# EAGLE board time-circuits (EAGLE 9.1.0)
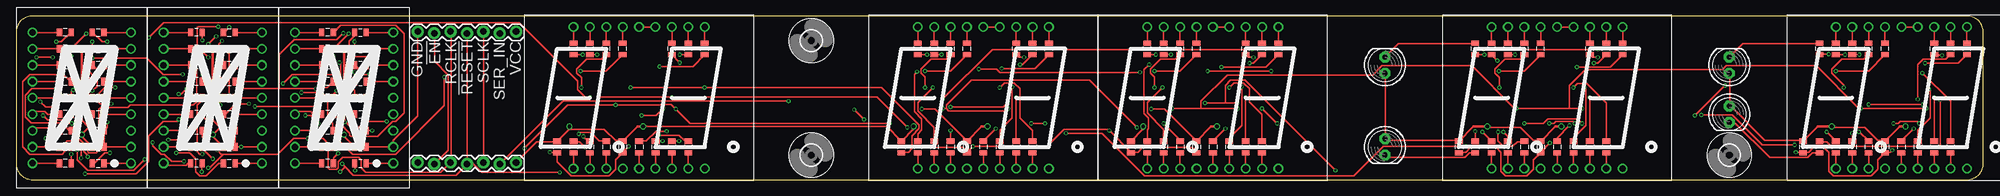
[diagram p2: board, top side]
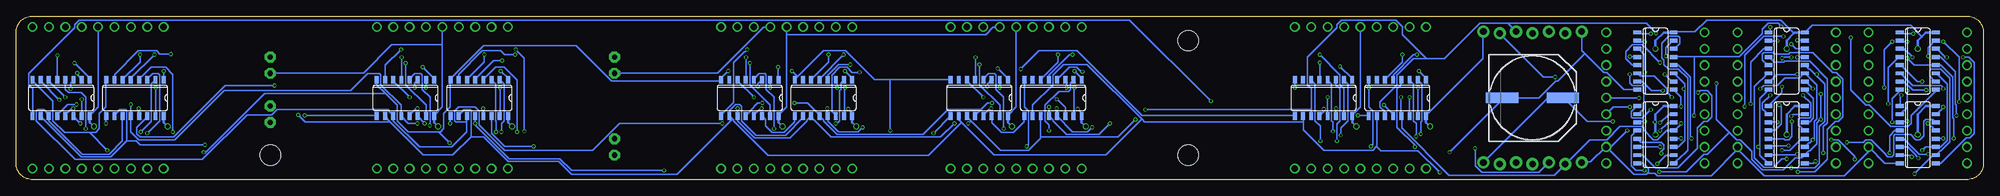
[diagram p3: board, bottom side, seen from below]

Size 304.8 x 25.4 mm. Coordinates in mm from the lower left corner, seen from the top.
Outline: 302.26,25.4 2.54,25.4 arc90 0,22.86 0,2.54 arc90 2.54,0 302.26,0 arc90 304.8,2.54 304.8,22.86 arc90 302.26,25.4
Copper layers (1*16): Top 0.0356mm / dielectric 1.5011mm / Bottom 0.0356mm
Design rules "OSHparkDruTented8mil": minimum track width 8mil, minimum drill 13mil, track to track 8mil, track to pad 8mil, pad to pad 8mil, via to via 8mil, smd to smd 5mil, copper to edge 15mil, drill to drill 6mil, minimum pad ring 5mil, minimum via ring 5mil, stop-mask expansion 3mil, vias tented up to drill 14mil, thermal gap 10mil
Net classes: 1 power: width 0.254 mm, clearance 0.203 mm

## Footprints (pad centres in the part's own frame; a part is rotated, then mirrored left to right if it is on the bottom)
0805 = smd 0.8 x 1.2: 1 -0.9,0; 2 0.9,0
PANASONIC_H13 = smd 5 x 1.6: + 4.7,0; - -4.7,0
3,2 = hole 3.2: 0,0
SO16 = smd 0.6 x 1.2: 1 -4.445,-2.8; 2 -3.175,-2.8; 3 -1.905,-2.8; 4 -0.635,-2.8; 5 0.635,-2.8; 6 1.905,-2.8; 7 3.175,-2.8; 8 4.445,-2.8; 9 4.445,2.8; 10 3.175,2.8; 11 1.905,2.8; 12 0.635,2.8; 13 -0.635,2.8; 14 -1.905,2.8; 15 -3.175,2.8; 16 -4.445,2.8
1X07_LOCK = drill 1.016 pad 1.88: 1 0,0.127; 2 2.54,-0.127; 3 5.08,0.127; 4 7.62,-0.127; 5 10.16,0.127; 6 12.7,-0.127; 7 15.24,0.127
LED5MM = drill 0.813 pad 1.676 octagon: A -1.27,0; K 1.27,0
DA08-11 = drill 1 pad 1.422: 1A -5.08,10.998; 1ANODE+ 0,10.998; 1B -2.54,10.998; 1C -5.08,-10.998; 1D -7.62,-10.998; 1DP -2.54,-10.998; 1E -10.16,-10.998; 1F -10.16,10.998; 1G -7.62,10.998; 2A 7.62,10.998; 2ANODE+ 2.54,10.998; 2B 10.16,10.998; 2C 7.62,-10.998; 2D 2.54,-10.998; 2DP 10.16,-10.998; 2E 0,-10.998; 2F 5.08,10.998; 2G 5.08,-10.998
PSC08-11 = drill 1: A -7.62,10.16; B 7.62,10.16; C 7.62,5.08; COM 7.62,-7.62; D 7.62,-2.54; DP 7.62,-5.08; E 7.62,-10.16; F -7.62,-10.16; G -7.62,-7.62; H -7.62,2.54; K -7.62,5.08; M -7.62,7.62; N 7.62,7.62; P 7.62,2.54; R 7.62,0; S -7.62,-2.54; T -7.62,-5.08; U -7.62,0

## Placement (x,y rotation side)
C1  [0805]  53.34,5.08 0 top
C2  [0805]  83.82,5.08 270 top
C3  [0805]  93.98,5.08 270 top
C4  [0805]  53.34,7.62 0 top
C5  [0805]  33.02,7.62 0 top
C6  [0805]  33.02,5.08 0 top
C7  [0805]  12.7,7.62 0 top
C8  [0805]  12.7,5.08 0 top
C9  [0805]  276.86,5.08 270 top
C10  [0805]  147.32,5.08 270 top
C11  [0805]  289.56,5.08 270 top
C12  [0805]  137.16,5.08 270 top
C13  [0805]  223.52,5.08 270 top
C14  [0805]  182.88,5.08 270 top
C15  [0805]  236.22,5.08 270 top
C16  [0805]  172.72,5.08 270 top
C17  [PANASONIC_H13]  69.85,12.7 0 bottom
H1  MOUNT-HOLE3.2  [3,2]  123.19,21.59 0 top
H2  MOUNT-HOLE3.2  [3,2]  265.43,3.81 0 top
H3  MOUNT-HOLE3.2  [3,2]  123.19,3.81 0 top
IC1  74LS595D  [SO16]  50.8,6.98 270 bottom
IC2  74LS595D  [SO16]  50.8,18.41 270 bottom
IC3  74LS595D  [SO16]  30.48,18.41 270 bottom
IC4  74LS595D  [SO16]  30.48,6.98 270 bottom
IC5  74LS595D  [SO16]  10.16,6.98 270 bottom
IC6  74LS595D  [SO16]  10.16,18.41 270 bottom
IC7  74LS595D  [SO16]  90.81,12.7 180 bottom
IC8  74LS595D  [SO16]  102.23,12.7 180 bottom
IC9  74LS595D  [SO16]  179.71,12.7 180 bottom
IC10  74LS595D  [SO16]  191.13,12.7 180 bottom
IC11  74LS595D  [SO16]  144.15,12.7 180 bottom
IC12  74LS595D  [SO16]  155.57,12.7 180 bottom
IC13  74LS595D  [SO16]  233.04,12.7 180 bottom
IC14  74LS595D  [SO16]  244.47,12.7 180 bottom
IC15  74LS595D  [SO16]  286.38,12.7 180 bottom
IC16  74LS595D  [SO16]  297.81,12.7 180 bottom
J1  [1X07_LOCK]  62.23,22.86 0 top
J2  [1X07_LOCK]  62.23,2.54 0 top
LED9  [LED5MM]  212.09,17.78 90 top
LED10  [LED5MM]  212.09,5.08 270 top
LED11  [LED5MM]  265.43,17.78 90 top
LED12  [LED5MM]  265.43,10.16 270 top
R1  [0805]  48.26,22.86 180 top
R2  [0805]  53.34,22.86 0 top
R7  [0805]  53.34,17.78 0 top
R8  [0805]  53.34,10.16 0 top
R9  [0805]  53.34,2.54 0 top
R10  [0805]  48.26,2.54 180 top
R11  [0805]  48.26,5.08 180 top
R12  [0805]  48.26,15.24 180 top
R13  [0805]  48.26,17.78 180 top
R14  [0805]  48.26,20.32 180 top
R15  [0805]  53.34,20.32 0 top
R16  [0805]  53.34,15.24 0 top
R17  [0805]  53.34,12.7 0 top
R18  [0805]  48.26,10.16 180 top
R19  [0805]  48.26,7.62 180 top
R20  [0805]  48.26,12.7 180 top
R21  [0805]  27.94,22.86 180 top
R22  [0805]  33.02,22.86 0 top
R23  [0805]  33.02,17.78 0 top
R24  [0805]  33.02,10.16 0 top
R25  [0805]  33.02,2.54 0 top
R26  [0805]  27.94,2.54 180 top
R27  [0805]  27.94,5.08 180 top
R28  [0805]  27.94,15.24 180 top
R29  [0805]  27.94,17.78 180 top
R30  [0805]  27.94,20.32 180 top
R31  [0805]  33.02,20.32 0 top
R32  [0805]  33.02,15.24 0 top
R33  [0805]  33.02,12.7 0 top
R34  [0805]  27.94,10.16 180 top
R35  [0805]  27.94,7.62 180 top
R36  [0805]  27.94,12.7 180 top
R37  [0805]  7.62,22.86 180 top
R38  [0805]  12.7,22.86 0 top
R39  [0805]  12.7,17.78 0 top
R40  [0805]  12.7,10.16 0 top
R41  [0805]  12.7,2.54 0 top
R42  [0805]  7.62,2.54 180 top
R43  [0805]  7.62,5.08 180 top
R44  [0805]  7.62,15.24 180 top
R45  [0805]  7.62,17.78 180 top
R46  [0805]  7.62,20.32 180 top
R47  [0805]  12.7,20.32 0 top
R48  [0805]  12.7,15.24 0 top
R49  [0805]  12.7,12.7 0 top
R50  [0805]  7.62,10.16 180 top
R51  [0805]  7.62,7.62 180 top
R52  [0805]  7.62,12.7 180 top
R53  [0805]  91.44,20.32 90 top
R54  [0805]  93.98,20.32 90 top
R55  [0805]  91.44,5.08 270 top
R56  [0805]  88.9,5.08 270 top
R57  [0805]  86.36,5.08 270 top
R58  [0805]  86.36,20.32 90 top
R59  [0805]  88.9,20.32 90 top
R60  [0805]  104.14,20.32 90 top
R61  [0805]  106.68,20.32 90 top
R62  [0805]  104.14,5.08 270 top
R63  [0805]  99.06,5.08 270 top
R64  [0805]  96.52,5.08 270 top
R65  [0805]  101.6,20.32 90 top
R66  [0805]  101.6,5.08 270 top
R67  [0805]  180.34,20.32 90 top
R68  [0805]  182.88,20.32 90 top
R69  [0805]  180.34,5.08 270 top
R70  [0805]  177.8,5.08 270 top
R71  [0805]  175.26,5.08 270 top
R72  [0805]  175.26,20.32 90 top
R73  [0805]  177.8,20.32 90 top
R74  [0805]  193.04,20.32 90 top
R75  [0805]  195.58,20.32 90 top
R76  [0805]  193.04,5.08 270 top
R77  [0805]  187.96,5.08 270 top
R78  [0805]  185.42,5.08 270 top
R79  [0805]  190.5,20.32 90 top
R80  [0805]  190.5,5.08 270 top
R81  [0805]  144.78,20.32 90 top
R82  [0805]  147.32,20.32 90 top
R83  [0805]  144.78,5.08 270 top
R84  [0805]  142.24,5.08 270 top
R85  [0805]  139.7,5.08 270 top
R86  [0805]  139.7,20.32 90 top
R87  [0805]  142.24,20.32 90 top
R88  [0805]  157.48,20.32 90 top
R89  [0805]  160.02,20.32 90 top
R90  [0805]  157.48,5.08 270 top
R91  [0805]  152.4,5.08 270 top
R92  [0805]  149.86,5.08 270 top
R93  [0805]  154.94,20.32 90 top
R94  [0805]  154.94,5.08 270 top
R95  [0805]  233.68,20.32 90 top
R96  [0805]  236.22,20.32 90 top
R97  [0805]  233.68,5.08 270 top
R98  [0805]  231.14,5.08 270 top
R99  [0805]  228.6,5.08 270 top
R100  [0805]  228.6,20.32 90 top
R101  [0805]  231.14,20.32 90 top
R102  [0805]  246.38,20.32 90 top
R103  [0805]  248.92,20.32 90 top
R104  [0805]  246.38,5.08 270 top
R105  [0805]  241.3,5.08 270 top
R106  [0805]  238.76,5.08 270 top
R107  [0805]  243.84,20.32 90 top
R108  [0805]  243.84,5.08 270 top
R109  [0805]  287.02,20.32 90 top
R110  [0805]  289.56,20.32 90 top
R111  [0805]  287.02,5.08 270 top
R112  [0805]  284.48,5.08 270 top
R113  [0805]  281.94,5.08 270 top
R114  [0805]  281.94,20.32 90 top
R115  [0805]  284.48,20.32 90 top
R116  [0805]  299.72,20.32 90 top
R117  [0805]  302.26,20.32 90 top
R118  [0805]  299.72,5.08 270 top
R119  [0805]  294.64,5.08 270 top
R120  [0805]  292.1,5.08 270 top
R121  [0805]  297.18,20.32 90 top
R122  [0805]  297.18,5.08 270 top
R123  [0805]  279.4,5.08 270 top
R124  [0805]  279.4,20.32 90 top
R125  [0805]  226.06,5.08 270 top
R126  [0805]  226.06,20.32 90 top
U$1  DA08-11  [DA08-11]  96.52,12.7 0 top
U$2  DA08-11  [DA08-11]  185.42,12.7 0 top
U$3  DA08-11  [DA08-11]  149.86,12.7 0 top
U$4  DA08-11  [DA08-11]  238.76,12.7 0 top
U$5  DA08-11  [DA08-11]  292.1,12.7 0 top
U$6  PSC08-11  [PSC08-11]  50.8,12.7 0 top
U$7  PSC08-11  [PSC08-11]  30.48,12.7 0 top
U$8  PSC08-11  [PSC08-11]  10.16,12.7 0 top

## Tracks (layer width: path | path; a pad name or v marks a point on that pad's centre or on a via)
DIN  (via drill 0.33)
  Top 0.203: v50.09,7.62 50.09,7.42 49.99,7.31 49.99,6.1 52.12,3.96 58.83,3.96 66.34,11.48 v66.34,15.95
  Bottom 0.203: v50.09,7.62 48.87,8.84 48.06,8.84 IC1.14 | v66.34,15.95 68.17,15.95 74.88,22.66 J1.6
G  (via drill 0.33)
  Top 0.203: v4.17,9.96 4.88,9.25 7.21,9.25 7.72,8.74 v8.64,8.74 8.84,8.74 9.35,8.23 9.35,6.71 9.86,6.2 9.96,6.2 11.07,5.08 11.07,4.37 11.28,4.17 12.39,4.17 12.8,4.57 12.8,10.87 13.11,11.18 17.27,11.18 17.68,11.58 27.43,11.58 27.94,12.09 v27.94,13.11 27.94,18.39 28.09,18.54 | 28.09,18.54 28.55,19 v28.85,19 | v31.29,23.77 28.25,23.77 28.04,23.57 28.04,18.59 28.09,18.54 | v90.22,12.8 v101.6,12.8 133.4,12.8 v138.07,8.13 | J1.2 64.82,22.66 64.82,18.39 66.95,16.26 66.95,4.57 64.82,2.44 J2.2 | v44.81,9.96 45.62,9.96 v46.84,8.74 | v143.56,11.07 144.07,11.07 144.12,11.02 | 144.12,11.02 144.47,10.67 153.31,10.67 v153.72,11.07 | v189.28,11.07 183.59,11.07 | 183.59,11.07 v179.12,11.07 | v173.63,8.13 166.32,15.44 148.03,15.44 144.17,11.58 144.17,11.07 144.12,11.02 | v242.62,11.07 240.69,11.07 | 240.69,11.07 v232.46,11.07 232.16,11.07 225.55,17.68 211.63,17.68 210.21,16.26 187.66,16.26 183.59,12.19 183.59,11.07 | v295.96,11.07 v285.8,11.07 285.5,11.07 278.89,17.68 264.97,17.68 264.36,17.07 243.13,17.07 240.69,14.63 240.69,11.07
  Bottom 0.203: v8.64,8.74 8.13,8.23 8.03,8.23 7.42,7.62 IC5.13 | v4.17,9.96 4.17,11.58 4.37,11.79 4.37,16.76 6.6,19 7.32,19 IC6.13 | v27.94,13.11 26.72,11.89 26.72,9.75 26.92,9.55 28.45,9.55 28.65,9.35 28.65,8.43 28.45,8.23 28.35,8.23 27.74,7.62 IC4.13 | v28.85,19 27.74,19 IC3.13 | 44.81,19.1 37.8,19.1 34.24,22.66 34.24,23.37 33.33,24.28 31.8,24.28 v31.29,23.77 | 44.81,19.1 47.95,19.1 IC2.13 | v101.6,12.8 IC8.13 | v90.22,12.8 90.22,9.96 IC7.13 90.12,9.85 90.12,8.03 82.8,0.71 66.45,0.71 64.82,2.34 J2.2 64.72,2.44 60.96,6.2 58.32,6.2 56.29,8.23 52.83,8.23 52.63,8.03 52.63,7.72 51.1,6.2 50.49,6.2 49.07,7.62 IC1.13 47.85,7.62 47.04,8.43 47.04,8.53 v46.84,8.74 | v44.81,9.96 44.81,19.1 | v143.56,11.07 143.56,9.96 IC11.13 143.56,9.85 141.12,7.42 138.79,7.42 v138.07,8.13 | v153.72,11.07 153.92,11.07 154.94,10.06 IC12.13 | v179.12,11.07 179.12,9.96 IC9.13 179.02,9.85 179.02,9.04 177.39,7.42 174.35,7.42 v173.63,8.13 | v189.28,11.07 189.48,11.07 190.5,10.06 IC10.13 | v232.46,11.07 232.46,9.96 IC13.13 | v242.62,11.07 242.82,11.07 243.84,10.06 IC14.13 | v285.8,11.07 285.8,9.96 IC15.13 | v295.96,11.07 296.16,11.07 297.18,10.06 IC16.13
GND  (via drill 0.33)
  Top 0.203: C1.2 U$6.COM 58.42,6.1 62.18,9.85 62.18,22.96 J1.1 | v55.17,7.62 C4.2 | 13.61,7.62 13.61,5.08 | v14.12,8.94 14.12,8.13 13.61,7.62 | 13.61,7.62 C7.2 | U$8.COM 13.61,5.08 | 13.61,5.08 C8.2 | 33.93,5.08 33.93,7.62 C5.2 | U$7.COM v34.85,5.08 33.93,5.08 | 33.93,5.08 C6.2 | v94.89,5.18 93.98,4.27 C3.2 93.98,4.17 92.86,3.05 92.86,1.63 91.85,0.61 85.95,0.61 83.82,2.74 C2.2 83.82,4.27 v82.7,4.27 | v95.2,14.33 v106.68,14.33 134.11,14.33 139.9,8.53 139.9,7.92 138.79,6.81 138.79,4.88 138.84,4.83 | 276.86,4.27 277.77,4.27 278.49,4.98 280.11,4.98 280.82,4.27 280.82,1.32 281.53,0.61 287.43,0.61 288.44,1.63 288.44,3.05 289.56,4.17 C11.2 289.56,4.27 290.37,4.27 v290.68,4.57 | C13.2 223.52,4.27 224.64,4.27 225.35,4.98 229.31,4.98 230.02,4.27 230.02,1.32 230.73,0.61 234.09,0.61 235.1,1.63 235.1,3.05 236.22,4.17 C15.2 236.22,4.27 v237.64,5.69 | 138.84,4.83 138.99,4.98 146.61,4.98 147.32,4.27 | 138.84,4.83 138.28,4.27 137.16,4.27 C12.2 | 147.32,4.27 v148.23,5.18 159.72,5.18 162.36,7.82 169.16,7.82 v169.37,7.62 172.72,4.27 | 147.32,4.27 C10.2 | 172.72,4.27 173.84,4.27 174.55,4.98 182.17,4.98 182.88,4.27 C14.2 | v184.61,16.87 v194.46,16.87 | 172.72,4.27 C16.2 | v275.74,4.27 276.86,4.27 | 276.86,4.27 C9.2
  Bottom 0.203: 53.65,2.54 IC1.8 52.73,2.54 51.92,1.73 51.92,1.12 51.97,1.07 | 51.97,1.07 52.22,0.81 54.15,0.81 U$6.COM | v55.17,7.62 58.01,4.77 U$6.COM | J2.1 62.18,2.74 60.86,2.74 58.52,5.08 U$6.COM | 13.01,14.02 IC6.8 13.01,13.92 13.01,13.72 14.12,12.6 v14.12,8.94 | IC5.8 13.01,2.54 15.24,2.54 U$8.COM 17.48,4.67 21.54,0.61 33.93,0.61 38.1,4.77 U$7.COM 38.1,4.67 42.16,0.61 50.49,0.61 50.9,1.02 51.92,1.02 51.97,1.07 | 34.65,5.08 34.65,12.6 33.33,13.92 IC3.8 33.33,14.02 | 34.65,5.08 34.65,3.76 34.04,3.15 33.93,3.15 33.33,2.54 IC4.8 | 34.65,5.08 v34.85,5.08 | 106.68,15.54 IC8.8 v106.68,14.33 | 95.3,15.54 IC7.8 95.2,15.44 v95.2,14.33 95.2,11.28 94.59,10.67 94.59,5.49 v94.89,5.18 | 53.65,14.02 IC2.8 53.75,14.02 55.68,14.02 58.32,16.66 58.83,16.66 61.72,19.56 | 61.72,19.56 62.18,20.02 62.18,22.96 J1.1 | 74.27,12.7 68.89,12.7 66.24,15.34 65.94,15.34 61.72,19.56 | 74.27,12.7 C17.- 74.47,12.7 | 74.27,12.7 v82.7,4.27 | 290.88,15.54 IC15.8 290.88,15.44 290.88,11.28 291.9,10.26 291.9,7.92 292.51,7.31 293.42,7.31 | 293.42,7.31 297.28,7.31 299.11,9.14 299.11,12.19 302.26,15.34 IC16.8 302.26,15.54 | 293.42,7.31 v290.68,4.57 | 237.54,15.54 IC13.8 | 239.37,7.42 244.04,7.42 245.77,9.14 245.77,11.58 247.65,13.46 | 239.37,7.42 239.06,7.42 238.56,7.92 238.56,10.26 237.54,11.28 237.54,15.44 IC13.8 | 247.65,13.46 248.92,14.73 IC14.8 248.92,15.54 | 239.37,7.42 v237.64,5.69 | 148.64,15.54 IC11.8 148.54,15.44 148.54,11.28 147.93,10.67 147.93,5.49 v148.23,5.18 | 169.37,15.54 171.81,15.54 176.28,20.02 179.73,20.02 183.74,16 | 169.37,15.54 160.02,15.54 IC12.8 | 183.74,16 184.2,15.54 IC9.8 | v194.46,16.87 195.58,15.75 195.58,15.54 IC10.8 195.58,15.44 195.68,15.34 212.55,15.34 218.03,20.83 232.36,20.83 237.54,15.65 IC13.8
  Bottom 0.203: 183.74,16 v184.61,16.87 | 169.37,15.54 v169.37,7.62 | v275.74,4.27 275.44,4.27 266.29,13.41 247.7,13.41 247.65,13.46
N$1  (via drill 0.33)
  Top 0.203: v5.69,19 v3.15,19
  Bottom 0.203: IC5.9 6.6,2.54 2.64,6.5 2.13,6.5 1.42,7.21 1.42,18.19 2.23,19 v3.15,19 | v5.69,19 5.89,19 7.21,20.32 IC6.14
N$2
  Bottom 0.203: IC2.14 47.85,20.32 47.04,21.13 47.04,22.05 47.24,22.25 48.77,22.25 49.78,21.23 49.78,18.9 49.48,18.59 49.48,17.88 48.77,17.17 47.24,17.17 45.82,15.75 45.82,4.57 47.24,3.15 47.35,3.15 47.95,2.54 IC1.9
N$3  (via drill 0.33)
  Top 0.203: v50.09,8.84 51.71,7.21 51.71,6.91 51.92,6.71 55.98,6.71 58.32,9.04 58.83,9.04 60.15,10.36 60.15,22.66 58.83,23.98 50.29,23.98 49.17,22.86 R1.1
  Bottom 0.203: IC1.15 48.77,10.16 v50.09,8.84
N$4  (via drill 0.33)
  Top 0.203: v51.51,10.87 51.31,11.07 51.31,18.69 51.61,19 51.61,21.54 52.43,22.35 52.43,22.86 R2.1
  Bottom 0.203: v51.51,10.87 52.83,9.55 54.36,9.55 54.56,9.75 54.56,10.57 53.65,11.48 IC1.1
N$5  (via drill 0.33)
  Top 0.203: v54.76,16.36 53.95,16.36 52.53,17.78 R7.1
  Bottom 0.203: v54.76,16.36 54.76,15.04 54.36,14.63 52.83,14.63 52.63,14.43 52.63,10.97 52.83,10.77 52.93,10.77 53.54,10.16 IC1.2
N$6  (via drill 0.33)
  Top 0.203: v52.43,9.04 52.43,10.16 R8.1
  Bottom 0.203: v52.43,9.04 53.44,9.04 53.54,8.94 IC1.3
N$7  (via drill 0.33)
  Top 0.203: v52.53,1.42 52.53,2.54 R9.1
  Bottom 0.203: v52.53,1.42 53.85,1.42 54.56,2.13 54.56,6.81 53.75,7.62 IC1.4
N$8  (via drill 0.33)
  Top 0.203: v49.89,4.06 49.17,3.35 49.17,2.54 R10.1
  Bottom 0.203: v49.89,4.06 49.89,4.37 49.48,4.77 49.48,5.38 49.89,5.79 53.03,5.79 53.54,6.3 IC1.5
N$9  (via drill 0.33)
  Top 0.203: v50.09,5.08 R11.1
  Bottom 0.203: IC1.6 v50.09,5.08
N$10  (via drill 0.33)
  Top 0.203: v44.2,13.51 46.74,13.51 47.55,14.33 48.16,14.33 49.07,15.24 R12.1
  Bottom 0.203: v44.2,13.51 43.89,13.82 42.77,13.82 42.06,13.11 42.06,9.75 42.77,9.04 43.28,9.04 44.3,8.03 44.3,4.88 47.35,1.83 50.8,1.83 52.73,3.76 53.54,3.76 IC1.7
N$11  (via drill 0.33)
  Top 0.203: v49.17,19.2 49.17,17.78 R13.1
  Bottom 0.203: v49.17,19.2 49.17,20.52 48.06,21.64 IC2.15
N$12  (via drill 0.33)
  Top 0.203: v51.51,22.66 49.17,20.32 R14.1
  Bottom 0.203: v51.51,22.66 53.34,22.66 53.54,22.86 IC2.1
N$13  (via drill 0.33)
  Top 0.203: v52.43,21.44 52.43,20.32 R15.1
  Bottom 0.203: v52.43,21.44 53.44,21.44 53.54,21.54 IC2.2
N$14
  Top 0.203: U$1.1A R53.2
N$15  (via drill 0.33)
  Top 0.203: v119.69,12.19 84.73,12.19 74.98,2.44 J2.6
  Bottom 0.203: IC16.9 302.26,14.12 302.87,14.73 302.87,16.46 295.76,23.57 295.76,24.08 295.05,24.79 132.28,24.79 v119.69,12.19
N$16
  Top 0.203: U$1.1B R54.2
N$17
  Top 0.203: U$1.1C R55.2
N$18  (via drill 0.33)
  Top 0.203: v52.43,16.66 52.43,15.24 R16.1
  Bottom 0.203: v52.43,16.66 52.43,19.3 53.44,20.32 IC2.3
N$19  (via drill 0.33)
  Top 0.203: v54.76,19.1 52.32,19.1 51.71,18.49 51.71,14.53 52.43,13.82 52.43,12.7 R17.1
  Bottom 0.203: v54.76,19.1 53.65,19.1 IC2.4
N$20
  Top 0.203: U$1.1D R56.2
N$21
  Top 0.203: U$1.1E R57.2
N$22
  Top 0.203: U$1.1F R58.2
N$23
  Top 0.203: U$1.1G R59.2
N$24
  Top 0.203: U$1.2A R60.2
N$25
  Top 0.203: U$1.2B R61.2
N$26
  Top 0.203: U$1.2C R62.2
N$27  (via drill 0.33)
  Top 0.203: v50.09,18.19 50.29,17.98 50.29,12.39 49.17,11.28 49.17,10.16 R18.1
  Bottom 0.203: v50.09,18.19 52.83,20.93 54.36,20.93 55.37,19.91 55.37,18.8 54.36,17.78 IC2.5
N$28  (via drill 0.33)
  Top 0.203: v48.26,12.8 48.26,9.55 49.07,8.74 49.07,7.62 R19.1
  Bottom 0.203: v48.26,12.8 49.07,13.61 49.07,14.12 51,16.05 53.14,16.05 53.54,16.46 IC2.6
N$29  (via drill 0.33)
  Top 0.203: v49.68,13.82 49.17,13.31 49.17,12.7 R20.1
  Bottom 0.203: v49.68,13.82 51.41,13.82 52.83,15.24 IC2.7
N$30
  Top 0.203: U$6.A R1.2
N$31
  Top 0.203: U$6.B R2.2
N$32
  Top 0.203: U$6.C R7.2
N$33  (via drill 0.33)
  Top 0.203: v54.76,11.28 54.25,10.77 54.25,10.16 R8.2
  Bottom 0.203: v54.76,11.28 57.3,11.28 U$6.D
N$34
  Top 0.203: U$6.E R9.2
N$35
  Top 0.203: U$6.F R10.2
N$36
  Top 0.203: U$6.G R11.2
N$37
  Top 0.203: U$6.H R12.2
N$38
  Top 0.203: U$6.K R13.2
N$39
  Top 0.203: U$6.M R14.2
N$40
  Top 0.203: U$6.N R15.2
N$41
  Top 0.203: U$6.P R16.2
N$42  (via drill 0.33)
  Top 0.203: v53.34,12.7 R17.2
  Bottom 0.203: U$6.R v53.34,12.7
N$43
  Top 0.203: R18.2 46.02,10.16 45.62,10.57 43.59,10.57 U$6.S
N$44
  Top 0.203: U$6.T R19.2
N$45
  Top 0.203: U$6.U R20.2
N$46
  Bottom 0.203: IC4.14 27.64,8.94 26.92,8.94 26.31,9.55 26.31,12.6 27.64,13.92 IC3.9
N$47  (via drill 0.33)
  Top 0.203: v28.85,21.64 28.85,22.86 R21.1
  Bottom 0.203: v28.85,21.64 27.74,21.64 IC3.15
N$48  (via drill 0.33)
  Top 0.203: v33.02,23.67 32.21,22.86 R22.1
  Bottom 0.203: v33.02,23.67 33.02,23.06 33.22,22.86 IC3.1
N$49  (via drill 0.33)
  Top 0.203: v31.9,21.54 31.39,21.03 31.39,19.61 32.11,18.9 32.11,17.78 R23.1
  Bottom 0.203: v31.9,21.54 33.22,21.54 IC3.2
N$50  (via drill 0.33)
  Top 0.203: R24.1 32.41,10.16 34.04,11.79 v36.07,11.79
  Bottom 0.203: v36.07,11.79 36.07,18.29 34.04,20.32 IC3.3
N$51  (via drill 0.33)
  Top 0.203: R25.1 31.39,2.54 29.46,0.61 28.45,0.61 27.84,1.22 27.84,3.25 26.92,4.17 v24.79,4.17
  Bottom 0.203: v24.79,4.17 24.79,8.23 24.18,8.84 24.18,15.65 26.92,18.39 30.79,18.39 30.89,18.29 32.41,18.29 33.22,19.1 IC3.4
N$52  (via drill 0.33)
  Top 0.203: v28.75,1.22 28.75,2.54 R26.1
  Bottom 0.203: v28.75,1.22 26.11,1.22 24.18,3.15 24.18,7.82 22.96,9.04 22.45,9.04 21.74,9.75 21.74,15.65 22.76,16.66 23.37,16.66 26.42,19.71 29.97,19.71 30.18,19.51 32.31,19.51 32.51,19.71 34.04,19.71 34.24,19.51 34.24,18.59 33.43,17.78 IC3.5
N$53  (via drill 0.33)
  Top 0.203: v30.48,3.25 28.85,4.88 28.85,5.08 R27.1
  Bottom 0.203: v30.48,3.25 31.19,3.25 32.51,1.93 34.04,1.93 35.46,3.35 35.46,14.43 33.33,16.56 IC3.6
N$54  (via drill 0.33)
  Top 0.203: v28.85,16.36 28.85,15.24 R28.1
  Bottom 0.203: v28.85,16.36 32,16.36 33.12,15.24 IC3.7
N$55  (via drill 0.33)
  Top 0.203: v29.77,9.85 29.77,16.87 28.85,17.78 R29.1
  Bottom 0.203: IC4.15 29.46,10.16 v29.77,9.85
N$56  (via drill 0.33)
  Top 0.203: v29.77,19 28.85,19.91 28.85,20.32 R30.1 | v31.19,14.43 v31.19,18.9
  Bottom 0.203: v29.77,19 31.09,19 v31.19,18.9 | v31.19,14.43 31.19,13.51 33.22,11.48 IC4.1
N$57  (via drill 0.33)
  Top 0.203: v33.02,13.11 33.02,19.51 32.21,20.32 R31.1
  Bottom 0.203: v33.02,13.11 34.24,11.89 34.24,10.97 34.04,10.77 33.93,10.77 33.33,10.16 IC4.2
N$58  (via drill 0.33)
  Top 0.203: v31.9,8.94 30.99,9.85 30.99,13.31 32.11,14.43 32.11,15.24 R32.1
  Bottom 0.203: v31.9,8.94 33.22,8.94 IC4.3
N$59  (via drill 0.33)
  Top 0.203: v31.6,11.58 31.6,12.19 32.11,12.7 R33.1
  Bottom 0.203: IC4.4 32.31,7.62 31.29,8.64 31.29,11.28 v31.6,11.58
N$60  (via drill 0.33)
  Top 0.203: v29.67,9.04 28.85,9.85 28.85,10.16 R34.1
  Bottom 0.203: v29.67,9.04 29.67,6.71 30.18,6.2 30.79,6.2 30.89,6.3 33.22,6.3 IC4.5
N$61  (via drill 0.33)
  Top 0.203: v30.18,5.28 28.85,6.6 28.85,7.62 R35.1
  Bottom 0.203: v30.18,5.28 33.02,5.28 33.22,5.08 IC4.6
N$62  (via drill 0.33)
  Top 0.203: v28.85,3.96 28.45,3.96 28.04,4.37 28.04,11.58 28.75,12.29 28.75,12.7 R36.1
  Bottom 0.203: v28.85,3.96 28.96,3.86 33.22,3.86 IC4.7
N$63
  Top 0.203: U$7.A R21.2
N$64
  Top 0.203: U$7.B R22.2
N$65
  Top 0.203: U$7.C R23.2
N$66
  Top 0.203: U$7.D R24.2
N$67
  Top 0.203: U$7.E R25.2
N$68
  Top 0.203: R26.2 26.62,2.54 26.31,2.23 23.16,2.23 U$7.F
N$69
  Top 0.203: U$7.G R27.2
N$70
  Top 0.203: U$7.H R28.2
N$71
  Top 0.203: U$7.K R29.2
N$72
  Top 0.203: U$7.M R30.2
N$73
  Top 0.203: U$7.N R31.2
N$74
  Top 0.203: U$7.P R32.2
N$75
  Top 0.203: U$7.R R33.2
N$76
  Top 0.203: U$7.S R34.2
N$77
  Top 0.203: U$7.T R35.2
N$78
  Top 0.203: U$7.U R36.2
N$79  (via drill 0.33)
  Top 0.203: v6.2,11.28 4.57,11.28 v3.76,12.09 | v6.2,21.44 7.01,21.44 8.43,22.86 R37.1
  Bottom 0.203: v6.2,11.28 6.2,11.18 6.6,10.77 6.71,10.77 7.32,10.16 IC5.15 | v3.76,12.09 3.76,19 v6.2,21.44
N$80  (via drill 0.33)
  Top 0.203: v12.7,13.11 12.7,13.31 13.72,14.33 v15.34,14.33 | v14.12,21.44 13.31,21.44 11.89,22.86 R38.1
  Bottom 0.203: v12.7,13.11 12.9,12.9 12.9,11.48 IC5.1 | v15.34,14.33 15.34,20.22 v14.12,21.44
N$81  (via drill 0.33)
  Top 0.203: v11.79,13.82 12.29,14.33 12.39,14.33 12.6,14.53 12.6,17.07 11.89,17.78 R39.1
  Bottom 0.203: v11.79,13.82 11.79,11.18 12.19,10.77 12.29,10.77 12.9,10.16 IC5.2
N$82  (via drill 0.33)
  Top 0.203: v11.79,9.04 11.79,10.16 R40.1
  Bottom 0.203: v11.79,9.04 12.8,9.04 12.9,8.94 IC5.3
N$83  (via drill 0.33)
  Top 0.203: R41.1 12.09,2.54 13.72,4.17 v14.53,4.17
  Bottom 0.203: v14.53,4.17 14.53,6.81 13.72,7.62 IC5.4
N$84  (via drill 0.33)
  Top 0.203: v8.53,3.96 8.53,2.54 R42.1
  Bottom 0.203: v8.53,3.96 9.96,3.96 12.29,6.3 12.9,6.3 IC5.5
N$85  (via drill 0.33)
  Top 0.203: R43.1 9.04,5.08 9.14,5.18 9.75,5.18 10.06,4.88 v10.06,3.35
  Bottom 0.203: v10.06,3.35 10.46,3.76 10.46,3.86 11.68,5.08 IC5.6
N$86  (via drill 0.33)
  Top 0.203: v11.07,3.56 11.07,3.76 10.46,4.37 10.46,5.08 9.75,5.79 9.25,5.79 9.04,5.99 7.92,5.99 7.52,5.59 7.52,4.37 7.11,3.96 2.13,3.96 1.02,5.08 1.02,15.24 2.13,16.36 7.32,16.36 8.43,15.24 R44.1
  Bottom 0.203: v11.07,3.56 11.28,3.76 12.9,3.76 IC5.7
N$87  (via drill 0.33)
  Top 0.203: v8.53,19.2 8.53,17.78 R45.1
  Bottom 0.203: v8.53,19.2 8.53,20.52 7.42,21.64 IC6.15
N$88  (via drill 0.33)
  Top 0.203: v10.87,22.66 8.53,20.32 R46.1
  Bottom 0.203: v10.87,22.66 12.7,22.66 12.9,22.86 IC6.1
N$89  (via drill 0.33)
  Top 0.203: v11.79,21.44 11.79,20.32 R47.1
  Bottom 0.203: v11.79,21.44 12.8,21.44 12.9,21.54 IC6.2
N$90  (via drill 0.33)
  Top 0.203: v10.97,19 10.97,17.17 11.79,16.36 11.79,15.24 R48.1
  Bottom 0.203: v10.97,19 12.29,20.32 IC6.3
N$91  (via drill 0.33)
  Top 0.203: R49.1 12.09,12.7 13.01,11.79 v14.73,11.79
  Bottom 0.203: v14.73,11.79 14.73,17.37 13.01,19.1 IC6.4
N$92  (via drill 0.33)
  Top 0.203: v9.45,15.24 9.45,12.19 8.53,11.28 8.53,10.16 R50.1
  Bottom 0.203: v9.45,15.24 10.26,15.24 12.8,17.78 IC6.5
N$93  (via drill 0.33)
  Top 0.203: R51.1 8.23,7.62 7.01,8.84 2.34,8.84 1.42,9.75 1.42,13.11 2.44,14.12 v6.2,14.12
  Bottom 0.203: v6.2,14.12 6.4,14.33 6.4,14.43 6.6,14.63 10.97,14.63 12.9,16.56 IC6.6
N$94  (via drill 0.33)
  Top 0.203: v8.84,13.92 8.53,13.61 8.53,12.7 R52.1
  Bottom 0.203: v8.84,13.92 10.97,13.92 12.29,15.24 IC6.7
N$95
  Top 0.203: U$8.A R37.2
N$96
  Top 0.203: U$8.B R38.2
N$97
  Top 0.203: U$8.C R39.2
N$98
  Top 0.203: U$8.D R40.2
N$99
  Top 0.203: U$8.E R41.2
N$100
  Top 0.203: U$8.F R42.2
N$101
  Top 0.203: U$8.G R43.2
N$102
  Top 0.203: U$8.H R44.2
N$103
  Top 0.203: U$8.K R45.2
N$104
  Top 0.203: U$8.M R46.2
N$105
  Top 0.203: U$8.N R47.2
N$106
  Top 0.203: U$8.P R48.2
N$107
  Top 0.203: U$8.R R49.2
N$108
  Top 0.203: R50.2 4.88,10.16 4.47,10.57 2.95,10.57 U$8.S
N$109
  Top 0.203: R51.2 5.28,7.62 4.88,8.03 2.95,8.03 U$8.T
N$110
  Top 0.203: U$8.U R52.2
N$111  (via drill 0.33)
  Top 0.203: v30.99,22.25 v29.77,21.03 | v46.84,11.38 v36.98,11.38
  Bottom 0.203: IC3.14 29.06,20.32 v29.77,21.03 | v30.99,22.25 34.04,22.25 36.98,19.3 v36.98,11.38 | v46.84,11.38 46.84,12.8 47.95,13.92 IC2.9
N$112  (via drill 0.33)
  Top 0.203: v26.01,2.84 24.08,2.84 22.96,3.96 22.45,3.96 21.13,5.28 v21.13,5.79
  Bottom 0.203: IC4.9 26.31,2.54 v26.01,2.84 | v21.13,5.79 18.59,5.79 18.19,6.2 17.37,6.2 15.14,3.96 15.14,3.86 14.83,3.56 14.22,3.56 13.92,3.86 13.92,6.81 13.72,7.01 11.28,7.01 10.46,6.2 9.86,6.2 9.25,6.81 9.25,9.04 8.94,9.35 7.82,9.35 7.42,8.94 IC5.14
N$113  (via drill 0.33)
  Top 0.203: v20.52,22.05 22.86,24.38 77.93,24.38 86.97,15.34 86.97,14.02 88.19,12.8 v88.9,12.8
  Bottom 0.203: v20.52,22.05 20.52,13.92 18.19,11.58 17.68,11.58 14.33,8.23 11.68,8.23 11.18,8.74 11.18,9.96 7.42,13.72 7.42,13.92 IC6.9 | IC7.14 v88.9,12.8
N$114  (via drill 0.33)
  Top 0.203: v87.58,14.33 87.58,15.85 86.87,16.56 86.87,17.17 88.39,18.69 90.73,18.69 91.44,19.41 R53.1
  Bottom 0.203: v87.58,14.33 87.58,9.96 IC7.15
N$115  (via drill 0.33)
  Top 0.203: v87.48,16.87 91.44,16.87 93.98,19.41 R54.1
  Bottom 0.203: IC7.1 86.36,15.75 v87.48,16.87
N$116  (via drill 0.33)
  Top 0.203: v87.17,7.11 87.38,7.31 89,7.31 90.32,5.99 91.44,5.99 R55.1
  Bottom 0.203: v87.17,7.11 87.17,8.94 86.97,9.14 86.97,14.83 87.58,15.44 IC7.2
N$117  (via drill 0.33)
  Top 0.203: v87.88,6.71 88.59,5.99 88.9,5.99 R56.1
  Bottom 0.203: v87.88,6.71 87.88,8.74 88.29,9.14 88.29,14.83 88.9,15.44 IC7.3
N$118  (via drill 0.33)
  Top 0.203: v88.09,5.08 87.27,5.89 86.36,5.89 R57.1
  Bottom 0.203: v88.09,5.08 88.09,5.38 90.83,8.13 90.83,14.12 90.22,14.73 90.22,15.44 IC7.4
N$119  (via drill 0.33)
  Top 0.203: v87.78,19.41 86.36,19.41 R58.1
  Bottom 0.203: v87.78,19.41 88.29,19.41 91.44,16.26 IC7.5
N$120  (via drill 0.33)
  Top 0.203: v90.02,19.41 88.9,19.41 R59.1
  Bottom 0.203: v90.02,19.41 90.02,18.29 92.76,15.54 IC7.6
N$121  (via drill 0.33)
  Top 0.203: v96.93,9.96 99.16,9.96 v100.28,11.07
  Bottom 0.203: v96.93,9.96 95.3,9.96 IC7.9 | v100.28,11.07 100.28,9.96 IC8.14
N$122  (via drill 0.33)
  Top 0.203: v102.82,19.41 104.14,19.41 R60.1
  Bottom 0.203: IC8.15 99.06,14.12 99.67,14.73 99.67,16.26 v102.82,19.41
N$123  (via drill 0.33)
  Top 0.203: v99.67,17.58 104.85,17.58 106.68,19.41 R61.1
  Bottom 0.203: v99.67,17.58 97.84,15.75 97.84,15.54 IC8.1
N$124  (via drill 0.33)
  Top 0.203: v99.57,6.91 102.72,6.91 103.63,5.99 104.14,5.99 R62.1
  Bottom 0.203: v99.57,6.91 99.57,8.03 98.45,9.14 98.45,14.83 99.06,15.44 IC8.2
N$125  (via drill 0.33)
  Top 0.203: v100.18,5.99 99.06,5.99 R63.1
  Bottom 0.203: v100.18,5.99 100.18,8.64 99.67,9.14 99.67,14.12 100.28,14.73 100.28,15.44 IC8.3
N$126  (via drill 0.33)
  Top 0.203: v100.79,7.52 99.16,7.52 97.64,5.99 96.52,5.99 R64.1
  Bottom 0.203: v100.79,7.52 100.79,8.94 100.99,9.14 100.99,14.83 101.6,15.44 IC8.4
N$127  (via drill 0.33)
  Top 0.203: v102.82,18.19 101.6,19.41 R65.1
  Bottom 0.203: v102.82,18.19 102.82,15.54 IC8.5
N$128  (via drill 0.33)
  Top 0.203: v102.72,5.99 101.6,5.99 R66.1
  Bottom 0.203: v102.72,5.99 102.72,8.33 103.53,9.14 103.53,14.83 104.14,15.44 IC8.6
N$129
  Top 0.203: U$1.2D R63.2
N$130
  Top 0.203: U$1.2E R64.2
N$131
  Top 0.203: U$1.2F R65.2
N$132
  Top 0.203: U$1.2G R66.2
N$133
  Top 0.203: U$2.1A R67.2
N$134
  Top 0.203: U$2.1B R68.2
N$135
  Top 0.203: U$2.1C R69.2
N$136
  Top 0.203: U$2.1D R70.2
N$137
  Top 0.203: U$2.1E R71.2
N$138
  Top 0.203: U$2.1F R72.2
N$139
  Top 0.203: U$2.1G R73.2
N$140
  Top 0.203: U$2.2A R74.2
N$141
  Top 0.203: U$2.2B R75.2
N$142
  Top 0.203: U$2.2C R76.2
N$143  (via drill 0.33)
  Top 0.203: v149.15,17.17 151.89,17.17 152.4,16.66 v174.14,16.66
  Bottom 0.203: v149.15,17.17 146.3,20.02 140.41,20.02 130.35,9.96 106.68,9.96 IC8.9 | v174.14,16.66 175.26,16.66 176.07,17.48 177.19,17.48 178.41,16.26 178.41,10.57 177.8,9.96 IC9.14
N$144  (via drill 0.33)
  Top 0.203: v176.38,14.33 176.38,15.95 175.77,16.56 175.77,17.17 177.29,18.69 179.63,18.69 180.34,19.41 R67.1
  Bottom 0.203: v176.38,14.33 176.48,14.22 176.48,9.96 IC9.15
N$145  (via drill 0.33)
  Top 0.203: v176.38,16.87 180.34,16.87 182.88,19.41 R68.1
  Bottom 0.203: IC9.1 175.26,15.75 v176.38,16.87
N$146  (via drill 0.33)
  Top 0.203: R69.1 180.34,6.2 v177.8,8.74
  Bottom 0.203: v177.8,8.74 177.6,8.74 177.19,9.14 177.19,13.82 176.99,14.02 176.99,15.04 176.58,15.44 IC9.2
N$147  (via drill 0.33)
  Top 0.203: R70.1 177.8,7.82 175.26,10.36 175.26,11.99 v177.6,14.33
  Bottom 0.203: v177.6,14.33 177.6,15.24 177.8,15.44 IC9.3
N$148  (via drill 0.33)
  Top 0.203: R71.1 175.26,7.72 175.46,7.92 175.46,9.55 174.75,10.26 174.75,17.07 v175.56,17.88
  Bottom 0.203: v175.56,17.88 177.39,17.88 179.02,16.26 179.02,15.54 IC9.4
N$149  (via drill 0.33)
  Top 0.203: v176.58,19.41 175.26,19.41 R72.1
  Bottom 0.203: v176.58,19.41 180.34,15.65 IC9.5
N$150  (via drill 0.33)
  Top 0.203: v178.92,19.41 177.8,19.41 R73.1
  Bottom 0.203: v178.92,19.41 178.92,18.29 181.66,15.54 IC9.6
N$151
  Top 0.203: U$2.2D R77.2
N$152
  Top 0.203: U$2.2E R78.2
N$153
  Top 0.203: U$2.2F R79.2
N$154
  Top 0.203: U$2.2G R80.2
N$155
  Top 0.203: U$3.1A R81.2
N$156
  Top 0.203: U$3.1B R82.2
N$157
  Top 0.203: U$3.1C R83.2
N$158
  Bottom 0.203: IC9.9 184.2,9.85 184.2,8.94 185.83,7.31 187.66,7.31 188.67,8.33 188.67,9.35 189.18,9.85 IC10.14
N$159  (via drill 0.33)
  Top 0.203: v191.11,18.09 191.72,18.09 193.04,19.41 R74.1
  Bottom 0.203: IC10.15 187.96,11.58 191.11,14.73 v191.11,18.09
N$160  (via drill 0.33)
  Top 0.203: v186.74,17.48 193.65,17.48 195.58,19.41 R75.1
  Bottom 0.203: v186.74,17.48 186.74,15.54 IC10.1
N$161  (via drill 0.33)
  Top 0.203: R76.1 193.04,10.16 191.11,12.09 191.11,14.12 190.19,15.04 188.67,15.04 v187.96,14.33
  Bottom 0.203: IC10.2 v187.96,14.33
N$162  (via drill 0.33)
  Top 0.203: R77.1 187.96,6.5 189.89,8.43 v189.89,14.43
  Bottom 0.203: v189.89,14.43 189.89,14.83 189.28,15.44 IC10.3
N$163  (via drill 0.33)
  Top 0.203: v187.35,7.92 185.42,5.99 R78.1
  Bottom 0.203: v187.35,7.92 187.35,12.8 188.57,14.02 188.57,16.26 188.77,16.46 189.69,16.46 190.5,15.65 IC10.4
N$164  (via drill 0.33)
  Top 0.203: v191.72,19 190.91,19 190.5,19.41 R79.1
  Bottom 0.203: v191.72,19 191.72,15.54 IC10.5
N$165  (via drill 0.33)
  Top 0.203: v190.5,12.8 R80.1
  Bottom 0.203: v190.5,12.8 193.04,15.34 IC10.6
N$166
  Top 0.203: U$3.1D R84.2
N$167
  Top 0.203: U$3.1E R85.2
N$168
  Top 0.203: U$3.1F R86.2
N$169
  Top 0.203: U$3.1G R87.2
N$170
  Top 0.203: U$3.2A R88.2
N$171
  Top 0.203: U$3.2B R89.2
N$172
  Top 0.203: U$3.2C R90.2
N$173  (via drill 0.33)
  Top 0.203: v143.56,12.5 151.28,20.22 v191.52,20.22
  Bottom 0.203: IC11.14 142.24,11.18 v143.56,12.5 | v191.52,20.22 191.82,19.91 191.92,19.91 193.65,18.19 193.65,11.99 195.58,10.06 IC10.9
N$174  (via drill 0.33)
  Top 0.203: v140.82,14.33 140.82,15.95 140.21,16.56 140.21,17.17 141.73,18.69 144.07,18.69 144.78,19.41 R81.1
  Bottom 0.203: v140.82,14.33 140.92,14.22 140.92,9.96 IC11.15
N$175  (via drill 0.33)
  Top 0.203: v140.82,16.87 144.78,16.87 147.32,19.41 R82.1
  Bottom 0.203: IC11.1 139.7,15.75 v140.82,16.87
N$176  (via drill 0.33)
  Top 0.203: v144.78,7.62 R83.1
  Bottom 0.203: v144.78,7.62 144.78,8.53 145.39,9.14 145.39,11.58 143.26,13.72 141.73,13.72 141.43,14.02 141.43,15.04 141.02,15.44 IC11.2
N$177  (via drill 0.33)
  Top 0.203: R84.1 142.24,8.13 139.7,10.67 139.7,11.99 v142.04,14.33
  Bottom 0.203: v142.04,14.33 142.04,15.24 142.24,15.44 IC11.3
N$178  (via drill 0.33)
  Top 0.203: R85.1 139.7,7.11 140.31,7.72 140.31,9.45 139.19,10.57 139.19,16.36 v139.6,16.76
  Bottom 0.203: v139.6,16.76 139.8,16.76 140.51,17.48 141.63,17.48 143.56,15.54 IC11.4
N$179  (via drill 0.33)
  Top 0.203: v141.12,19.41 139.7,19.41 R86.1
  Bottom 0.203: v141.12,19.41 141.63,19.41 144.78,16.26 IC11.5
N$180  (via drill 0.33)
  Top 0.203: v143.36,19.41 142.24,19.41 R87.1
  Bottom 0.203: v143.36,19.41 143.36,18.29 146.1,15.54 IC11.6
N$181
  Top 0.203: U$3.2D R91.2
N$182
  Top 0.203: U$3.2E R92.2
N$183
  Top 0.203: U$3.2F R93.2
N$184
  Top 0.203: U$3.2G R94.2
N$185
  Top 0.203: U$4.1A R95.2
N$186
  Top 0.203: U$4.1B R96.2
N$187
  Top 0.203: U$4.1C R97.2
N$188
  Bottom 0.203: IC11.9 148.64,9.85 148.64,8.94 150.27,7.31 152.09,7.31 153.62,8.84 153.62,9.85 IC12.14
N$189  (via drill 0.33)
  Top 0.203: v155.55,17.88 155.96,17.88 157.48,19.41 R88.1
  Bottom 0.203: IC12.15 152.4,11.58 155.55,14.73 v155.55,17.88
N$190  (via drill 0.33)
  Top 0.203: v152.71,17.27 157.89,17.27 160.02,19.41 R89.1
  Bottom 0.203: v152.71,17.27 151.18,15.75 151.18,15.54 IC12.1
N$191  (via drill 0.33)
  Top 0.203: R90.1 157.48,7.62 155.55,9.55 155.55,14.12 154.63,15.04 153.11,15.04 v152.4,14.33
  Bottom 0.203: IC12.2 v152.4,14.33
N$192  (via drill 0.33)
  Top 0.203: R91.1 152.4,7.62 154.33,9.55 v154.33,14.43
  Bottom 0.203: v154.33,14.43 154.33,14.83 153.72,15.44 IC12.3
N$193  (via drill 0.33)
  Top 0.203: v151.79,7.92 149.86,5.99 R92.1
  Bottom 0.203: v151.79,7.92 151.79,12.8 153.01,14.02 153.01,16.26 153.21,16.46 154.13,16.46 154.94,15.65 IC12.4
N$194  (via drill 0.33)
  Top 0.203: v156.16,19 155.35,19 154.94,19.41 R93.1
  Bottom 0.203: v156.16,19 156.16,15.54 IC12.5
N$195  (via drill 0.33)
  Top 0.203: v154.94,12.8 R94.1
  Bottom 0.203: v154.94,12.8 157.48,15.34 IC12.6
N$196
  Top 0.203: U$4.1D R98.2
N$197
  Top 0.203: U$4.1E R99.2
N$198
  Top 0.203: U$4.1F R100.2
N$199
  Top 0.203: U$4.1G R101.2
N$200
  Top 0.203: U$4.2A R102.2
N$201
  Top 0.203: U$4.2B R103.2
N$202
  Top 0.203: U$4.2C R104.2
N$203  (via drill 0.33)
  Top 0.203: v162.66,7.21 168.25,7.21 174.85,0.61 207.26,0.61 211.84,5.18 v224.64,5.18
  Bottom 0.203: v162.66,7.21 160.02,9.85 IC12.9 | v224.64,5.18 229.11,5.18 231.14,7.21 IC13.14
N$204  (via drill 0.33)
  Top 0.203: v229.82,14.33 229.82,15.85 229.11,16.56 229.11,17.17 230.63,18.69 232.97,18.69 233.68,19.41 R95.1
  Bottom 0.203: v229.82,14.33 229.82,9.96 IC13.15
N$205  (via drill 0.33)
  Top 0.203: v229.72,16.87 233.68,16.87 236.22,19.41 R96.1
  Bottom 0.203: IC13.1 228.6,15.75 v229.72,16.87
N$206  (via drill 0.33)
  Top 0.203: v229.62,7.42 229.62,5.99 230.43,5.18 231.85,5.18 232.56,5.89 233.68,5.89 R97.1
  Bottom 0.203: v229.62,7.42 229.62,8.74 229.21,9.14 229.21,14.83 229.82,15.44 IC13.2
N$207  (via drill 0.33)
  Top 0.203: R98.1 231.14,6.71 v230.43,7.42
  Bottom 0.203: v230.43,7.42 230.43,9.04 230.53,9.14 230.53,14.83 231.14,15.44 IC13.3
N$208  (via drill 0.33)
  Top 0.203: v227.18,7.42 228.6,5.99 R99.1
  Bottom 0.203: v227.18,7.42 227.18,15.44 229.21,17.48 230.53,17.48 232.46,15.54 IC13.4
N$209  (via drill 0.33)
  Top 0.203: v229.51,18.49 228.6,19.41 R100.1
  Bottom 0.203: v229.51,18.49 230.84,18.49 233.68,15.65 IC13.5
N$210  (via drill 0.33)
  Top 0.203: v232.26,19.41 231.14,19.41 R101.1
  Bottom 0.203: v232.26,19.41 232.26,18.29 235,15.54 IC13.6
N$211  (via drill 0.33)
  Top 0.203: v237.54,8.74 238.25,8.74 238.56,9.04 241.2,9.04 v241.5,8.74
  Bottom 0.203: v237.54,8.74 237.54,9.85 IC13.9 | v241.5,8.74 242.62,9.85 IC14.14
N$212  (via drill 0.33)
  Top 0.203: v244.45,18.09 245.06,18.09 246.38,19.41 R102.1
  Bottom 0.203: IC14.15 241.3,11.58 244.45,14.73 v244.45,18.09
N$213  (via drill 0.33)
  Top 0.203: v241.81,17.48 246.99,17.48 248.92,19.41 R103.1
  Bottom 0.203: v241.81,17.48 240.08,15.75 240.08,15.54 IC14.1
N$214  (via drill 0.33)
  Top 0.203: R104.1 246.38,11.89 243.33,14.93 241.91,14.93 v241.3,14.33
  Bottom 0.203: IC14.2 v241.3,14.33
N$215  (via drill 0.33)
  Top 0.203: R105.1 241.3,6.5 243.23,8.43 243.23,14.12 v243.03,14.33
  Bottom 0.203: v243.03,14.33 243.03,15.04 242.62,15.44 IC14.3
N$216  (via drill 0.33)
  Top 0.203: R106.1 238.76,6.5 v240.69,8.43
  Bottom 0.203: v240.69,8.43 240.69,12.8 241.91,14.02 241.91,16.26 242.11,16.46 243.03,16.46 243.84,15.65 IC14.4
N$217  (via drill 0.33)
  Top 0.203: v245.06,19 244.25,19 243.84,19.41 R107.1
  Bottom 0.203: v245.06,19 245.06,15.54 IC14.5
N$218  (via drill 0.33)
  Top 0.203: v243.84,12.8 R108.1
  Bottom 0.203: v243.84,12.8 246.38,15.34 IC14.6
N$219  (via drill 0.33)
  Top 0.203: v264.77,14.63 v260.1,9.96
  Bottom 0.203: v260.1,9.96 248.92,9.96 IC14.9 | v264.77,14.63 272.39,14.63 280.42,6.6 285.6,6.6 286.11,7.11 286.11,8.13 284.48,9.75 IC15.14
N$220  (via drill 0.33)
  Top 0.203: v283.16,14.33 283.16,14.73 281.33,16.56 281.33,17.17 282.85,18.69 286.31,18.69 287.02,19.41 R109.1
  Bottom 0.203: v283.16,14.33 283.16,9.96 IC15.15
N$221  (via drill 0.33)
  Top 0.203: v281.94,16.87 287.02,16.87 289.56,19.41 R110.1
  Bottom 0.203: v281.94,16.87 IC15.1
N$222  (via drill 0.33)
  Top 0.203: v285.5,7.42 285.6,7.42 287.02,5.99 R111.1
  Bottom 0.203: v285.5,7.42 283.87,9.04 283.87,14.83 283.26,15.44 IC15.2
N$223  (via drill 0.33)
  Top 0.203: v284.48,7.21 R112.1
  Bottom 0.203: v284.48,7.21 282.55,9.14 282.55,16.26 282.75,16.46 283.67,16.46 284.48,15.65 IC15.3
N$224  (via drill 0.33)
  Top 0.203: v280.52,7.42 281.94,5.99 R113.1
  Bottom 0.203: v280.52,7.42 280.52,16.36 281.63,17.48 283.87,17.48 285.8,15.54 IC15.4
N$225  (via drill 0.33)
  Top 0.203: v283.36,19.41 281.94,19.41 R114.1
  Bottom 0.203: v283.36,19.41 287.02,15.75 IC15.5
N$226  (via drill 0.33)
  Top 0.203: v285.6,19.41 284.48,19.41 R115.1
  Bottom 0.203: v285.6,19.41 285.6,18.29 288.34,15.54 IC15.6
N$227  (via drill 0.33)
  Top 0.203: v290.88,8.74 291.59,8.74 291.9,9.04 294.54,9.04 v294.84,8.74
  Bottom 0.203: v290.88,8.74 290.88,9.85 IC15.9 | v294.84,8.74 295.96,9.85 IC16.14
N$228  (via drill 0.33)
  Top 0.203: v294.64,12.5 294.64,17.88 295.45,18.69 299.01,18.69 299.72,19.41 R116.1
  Bottom 0.203: v294.64,12.5 IC16.15
N$229  (via drill 0.33)
  Top 0.203: v295.76,18.09 300.94,18.09 302.26,19.41 R117.1
  Bottom 0.203: v295.76,18.09 293.42,15.75 293.42,15.54 IC16.1
N$230  (via drill 0.33)
  Top 0.203: R118.1 299.72,12.19 v295.35,16.56
  Bottom 0.203: v295.35,16.56 295.35,16.36 294.64,15.65 IC16.2
N$231  (via drill 0.33)
  Top 0.203: R119.1 294.64,7.62 296.57,9.55 296.57,13.92 v296.37,14.12
  Bottom 0.203: v296.37,14.12 296.37,15.04 295.96,15.44 IC16.3
N$232  (via drill 0.33)
  Top 0.203: v294.03,7.92 292.1,5.99 R120.1
  Bottom 0.203: v294.03,7.92 294.03,12.8 294.74,13.51 296.67,13.51 297.18,14.02 IC16.4
N$233  (via drill 0.33)
  Top 0.203: v298.4,19.3 297.28,19.3 297.18,19.41 R121.1
  Bottom 0.203: v298.4,19.3 298.4,15.54 IC16.5
N$234  (via drill 0.33)
  Top 0.203: v297.18,12.8 R122.1
  Bottom 0.203: v297.18,12.8 299.72,15.34 IC16.6
N$235
  Top 0.203: U$4.2D R105.2
N$236
  Top 0.203: U$4.2E R106.2
N$237
  Top 0.203: U$4.2F R107.2
N$238
  Top 0.203: U$4.2G R108.2
N$239
  Top 0.203: U$5.1A R109.2
N$240
  Top 0.203: U$5.1B R110.2
N$241
  Top 0.203: U$5.1C R111.2
N$242
  Top 0.203: U$5.1D R112.2
N$243
  Top 0.203: U$5.1E R113.2
N$244
  Top 0.203: U$5.1F R114.2
N$245
  Top 0.203: U$5.1G R115.2
N$246
  Top 0.203: U$5.2A R116.2
N$247
  Top 0.203: U$5.2B R117.2
N$248
  Top 0.203: U$5.2C R118.2
N$249
  Top 0.203: U$5.2D R119.2
N$250
  Top 0.203: U$5.2E R120.2
N$251
  Top 0.203: U$5.2F R121.2
N$252
  Top 0.203: U$5.2G R122.2
N$263  (via drill 0.33)
  Top 0.203: v298.09,12.39 298.09,5.38 297.89,5.18 281.23,5.18 280.52,5.89 279.4,5.89 R123.1
  Bottom 0.203: v298.09,12.39 300.94,15.24 300.94,15.44 IC16.7
N$264  (via drill 0.33)
  Top 0.203: v280.82,19.51 279.4,19.51 R124.1
  Bottom 0.203: v280.82,19.51 282.55,19.51 283.06,20.02 285.9,20.02 289.56,16.36 IC15.7
N$265  (via drill 0.33)
  Top 0.203: v226.06,7.52 R125.1 | v245.16,20.22 v227.38,20.22
  Bottom 0.203: v226.06,7.52 226.06,18.9 v227.38,20.22 | v245.16,20.22 247.6,17.78 247.6,15.54 IC14.7
N$266  (via drill 0.33)
  Top 0.203: v227.48,19.41 226.06,19.41 R126.1
  Bottom 0.203: v227.48,19.41 229.11,19.41 229.72,20.02 232.56,20.02 236.22,16.36 IC13.7
N$267
  Top 0.203: LED9.K 214.17,21.13 226.06,21.13 R126.2
N$268
  Top 0.203: LED10.K 212.45,3.45 224.43,3.45 225.15,4.17 226.06,4.17 R125.2
N$269
  Top 0.203: LED11.K 267.51,21.13 279.4,21.13 R124.2
N$270
  Top 0.203: R123.2 279.4,4.17 278.28,4.17 277.57,3.45 271.68,3.45 266.29,8.84 265.48,8.84 LED12.K
RCK  (via drill 0.33)
  Top 0.203: v233.68,8.74 236.63,8.74 237.34,9.45 241.91,9.45 v242.62,8.74 | v295.45,11.68 v287.02,11.68 | v4.57,6.4 v6.2,6.4 | v31.19,4.57 31.8,3.96 32.11,3.96 | 32.11,3.96 40.54,3.96 42.98,6.4 v45.21,6.4 v46.84,6.4 47.55,6.4 48.36,5.59 48.36,1.83 48.56,1.63 49.68,1.63 49.89,1.83 49.89,2.74 50.6,3.45 53.03,3.45 53.44,3.05 53.44,1.83 54.15,1.12 65.73,1.12 67.26,2.64 J2.3 67.36,2.74 67.36,22.96 J1.3 | v29.77,1.83 29.97,1.83 32.11,3.96 | v11.79,18.9 20.22,18.9 22.76,16.36 v25.81,16.36 | v144.78,11.28 153.01,11.28 v153.62,11.89 | v184.2,11.89 187.35,11.89 | 187.35,11.89 v189.18,11.89 | v78.74,4.88 85.45,11.58 v92.86,11.58 99.87,11.58 99.97,11.68 101.5,11.68 v102.21,10.97 104.44,8.74 v135.33,8.74 | v204.42,1.42 190.4,15.44 188.16,15.44 187.35,14.63 187.35,11.89
  Bottom 0.203: IC13.12 v233.68,8.74 233.68,8.53 228.4,3.25 220.57,3.25 218.75,1.42 v204.42,1.42 | v242.62,8.74 244.04,8.74 245.16,9.85 IC14.12 245.16,9.96 245.16,11.58 248.31,14.73 248.31,16.26 248.51,16.46 250.34,16.46 252.98,13.82 272.59,13.82 280.21,6.2 285.8,6.2 287.02,7.42 IC15.12 v287.02,11.68 | v295.45,11.68 296.77,11.68 298.5,9.96 IC16.12 | v6.2,6.4 7.32,6.4 IC5.12 | v4.57,6.4 4.57,9.45 4.78,9.65 4.78,15.95 6.6,17.78 IC6.12 10.67,17.78 v11.79,18.9 | v31.19,4.57 29.97,4.57 28.25,6.3 27.74,6.3 IC4.12 | v46.84,6.4 47.95,6.4 IC1.12 | 25.96,16.2 24.59,14.83 24.59,9.04 25.4,8.23 25.4,2.54 26.11,1.83 v29.77,1.83 | 25.96,16.2 26.92,17.17 27.03,17.17 27.64,17.78 IC3.12 | IC2.12 47.24,17.78 45.41,15.95 45.41,6.6 v45.21,6.4 | 25.96,16.2 v25.81,16.36 | v144.78,11.28 IC11.12 144.78,9.85 144.17,9.25 144.17,9.14 142.04,7.01 137.06,7.01 v135.33,8.74 | v153.62,11.89 154.33,11.89 155.4,10.82 | 155.4,10.82 156.26,9.96 IC12.12 | 155.4,10.82 155.45,10.87 160.43,10.87 164.29,7.01 177.6,7.01 179.73,9.14 179.73,9.25 180.34,9.85 IC9.12 180.34,10.06 182.17,11.89 v184.2,11.89 | v189.18,11.89 189.89,11.89 191.11,10.67 191.11,10.57 191.72,9.96 IC10.12 | IC7.12 91.44,10.16 v92.86,11.58 | v102.21,10.97 102.21,10.57 102.82,9.96 IC8.12 | v78.74,4.88 78.74,2.13 77.72,1.12 68.89,1.12 67.36,2.64 J2.3
SCK  (via drill 0.33)
  Top 0.203: v9.45,4.57 9.45,3.05 11.07,1.42 18.19,1.42 v19.91,3.15 | v26.42,6.2 v23.57,6.2 | v34.54,14.12 40.74,14.12 | 40.74,14.12 v46.43,14.12 | v157.28,8.74 v159.41,8.74 | J2.5 72.44,2.74 72.44,22.96 J1.5 | v129.84,10.87 v131.37,9.35 | 40.74,14.12 40.74,19.41 43.08,21.74 49.68,21.74 v50.7,22.76 | v193.04,11.07 v195.38,8.74
  Bottom 0.203: 235,8.94 235,7.42 237.34,5.08 242.32,5.08 246.38,9.14 IC14.11 246.38,9.96 246.99,10.57 246.99,10.67 247.19,10.87 264.36,10.87 265.18,10.06 269.04,10.06 275.95,3.15 295.66,3.15 301.65,9.14 301.65,10.67 301.45,10.87 300.53,10.87 299.72,10.06 IC16.11 299.72,9.14 294.54,3.96 290.37,3.96 288.34,5.99 288.34,9.85 IC15.11 | 235,8.94 235,9.85 IC13.11 | IC1.11 47.24,5.08 46.23,6.1 46.23,14.12 | 46.23,14.12 46.23,14.83 47.95,16.56 IC2.11 | IC6.11 7.32,16.56 5.59,14.83 5.59,6.1 6.6,5.08 IC5.11 8.94,5.08 v9.45,4.57 | IC4.11 27.64,5.08 27.03,5.69 26.92,5.69 v26.42,6.2 26.21,6.4 26.21,9.04 25.81,9.45 25.81,14.73 27.64,16.56 IC3.11 27.74,16.56 28.55,15.75 30.79,15.75 31.9,14.63 34.04,14.63 v34.54,14.12 | v19.91,3.15 19.91,3.66 22.45,6.2 v23.57,6.2 | v46.43,14.12 46.23,14.12 | 146.1,6.6 146.1,6.4 147.93,4.57 152.3,4.57 156.87,9.14 | 146.1,6.6 146.1,9.85 IC11.11 | 156.87,9.14 157.48,9.75 IC12.11 | v159.41,8.74 161.54,6.6 178.51,6.6 181.66,9.75 IC9.11 181.66,9.85 182.27,9.25 182.27,9.14 184.91,6.5 190.4,6.5 193.04,9.14 IC10.11 v193.04,11.07 | 156.87,9.14 v157.28,8.74 | 86.26,18.8 83.52,18.8 78.03,24.28 73.66,24.28 73.61,24.23 | 86.26,18.8 88.29,18.8 90.83,16.26 90.83,14.73 93.47,12.09 93.47,11.28 92.76,10.57 92.76,9.96 IC7.11 | 73.61,24.23 72.44,23.06 J1.5 | 104.14,10.87 104.14,14.12 104.75,14.73 104.75,19 100.18,23.57 100.18,24.08 99.47,24.79 91.03,24.79 90.02,23.77 90.02,22.55 86.26,18.8 | 104.14,10.87 IC8.11 | 146.1,6.6 134.11,6.6 v131.37,9.35 | 104.14,10.87 v129.84,10.87 | v50.7,22.76 52.22,24.28 73.56,24.28 73.61,24.23 | 235,8.94 236.63,8.94 236.83,9.14 236.83,10.67 236.22,11.28 233.68,11.28 233.07,10.67 233.07,8.53 229.11,4.57 215.49,4.57 211.33,8.74 v195.38,8.74
SCL  (via drill 0.33)
  Top 0.203: 50.95,1.98 52.22,0.71 68.17,0.71 69.8,2.34 J2.4 | 50.95,1.98 v50.49,2.44 | J1.4 69.9,22.66 69.9,2.44 J2.4 | v25.2,13.31 25.6,13.31 v26.42,14.12 | v49.38,16.36 42.77,16.36 v41.35,14.93 | v10.67,0.91 18.59,0.91 20.52,2.84 20.52,6.81 22.76,9.04 24.89,9.04 v25.2,9.35 | v50.19,1.22 50.95,1.98 | v275.54,5.38 270.56,5.38 265.89,10.06 v261.11,10.06 | v84.23,1.12 72.14,1.12 70.81,2.44 70,2.44 J2.4
  Bottom 0.203: v50.49,2.44 49.17,3.76 48.06,3.76 IC1.10 | IC6.10 7.52,15.24 8.33,16.05 8.33,16.97 8.13,17.17 6.6,17.17 5.18,15.75 5.18,5.89 6.6,4.47 6.71,4.47 7.32,3.86 IC5.10 7.42,3.76 7.82,3.76 v10.67,0.91 | 25.25,9.4 25.2,9.45 v25.2,13.31 | 25.25,9.4 25.81,8.84 25.81,5.59 26.92,4.47 27.03,4.47 27.64,3.86 IC4.10 27.74,3.76 28.14,3.35 29.16,3.35 30.99,1.52 34.24,1.52 35.87,3.15 35.87,4.37 37.69,6.2 38.2,6.2 39.37,7.37 | v26.42,14.12 27.53,15.24 IC3.10 | IC2.10 48.26,15.24 v49.38,16.36 | v41.35,14.93 41.35,9.35 39.37,7.37 | v25.2,9.35 25.25,9.4 | v50.19,1.22 46.02,1.22 43.28,3.96 42.77,3.96 39.37,7.37 | 287.68,6.04 290.17,3.56 294.74,3.56 301.04,9.85 IC16.10 | 287.68,6.04 287.63,6.1 287.63,10.67 287.83,10.87 288.75,10.87 288.95,10.67 288.95,10.57 289.56,9.96 IC15.10 | 234.34,6.65 237.13,3.86 241.71,3.86 246.84,8.99 | 234.34,6.65 234.29,6.71 234.29,10.67 234.49,10.87 235.41,10.87 235.61,10.67 235.61,10.57 236.22,9.96 IC13.10 | 246.84,8.99 247.7,9.85 IC14.10 | IC9.10 182.88,9.65 185.62,6.91 190.19,6.91 192.43,9.14 192.43,11.38 192.74,11.68 193.34,11.68 194.26,10.77 194.26,9.96 IC10.10 194.26,9.85 193.8,9.4 | IC7.10 93.98,5.18 94.03,5.13 | 94.03,5.13 94.59,4.57 102.21,4.57 105.36,7.72 105.36,8.94 | 105.36,8.94 105.36,9.85 IC8.10 | IC11.10 147.32,11.58 144.17,14.73 144.17,16.26 142.54,17.88 138.89,17.88 130.4,9.4 | 130.4,9.4 129.95,8.94 105.36,8.94 | 158.34,8.89 153.31,3.86 135.94,3.86 130.4,9.4 | 158.34,8.89 158.7,9.25 158.7,9.85 IC12.10 | 193.8,9.4 193.65,9.25 193.65,9.14 188.26,3.76 163.47,3.76 158.34,8.89 | 193.8,9.4 202.39,0.81 218.75,0.81 220.78,2.84 228.6,2.84 232.36,6.6 234.29,6.6 234.34,6.65
  Bottom 0.203: v275.54,5.38 285.6,5.38 286.21,5.99 287.63,5.99 287.68,6.04 | v261.11,10.06 259.99,8.94 246.89,8.94 246.84,8.99 | v84.23,1.12 87.58,4.47 93.37,4.47 94.03,5.13
VCC  (via drill 0.33, 0.6)
  Top 0.254: v50.9,8.94 51.01,9.05 | 11.29,8.13 10.26,7.11 v10.16,6.98 | 31.61,8.13 30.58,7.11 v30.48,6.98 | U$1.1ANODE+ 96.52,23.67 99.06,23.67 U$1.2ANODE+ | C2.1 83.72,5.89 80.67,5.89 77.52,2.74 J2.7 | C3.1 93.88,6.1 92.86,6.1 91.14,7.82 85.85,7.82 v85.72,8.25 | v57.4,9.04 54.05,9.04 52.63,7.62 C4.1 | U$3.1ANODE+ 149.86,23.67 152.4,23.67 U$3.2ANODE+ | v140.31,10.97 142.34,10.97 147.22,6.1 C10.1 | U$2.1ANODE+ 185.42,23.67 187.96,23.67 U$2.2ANODE+ | v175.87,10.97 177.9,10.97 182.78,6.1 C14.1 | U$5.1ANODE+ 292.1,23.67 294.64,23.67 U$5.2ANODE+ | C11.1 289.46,6.1 288.44,6.1 286.41,8.13 281.43,8.13 v281.31,8.25 | LED11.A 265.48,16.46 265.48,11.48 LED12.A 265.58,11.48 270.97,6.1 276.76,6.1 C9.1 | U$4.1ANODE+ 238.76,23.67 241.3,23.67 U$4.2ANODE+ | C15.1 236.12,6.1 235.1,6.1 233.07,8.13 228.09,8.13 v227.97,8.25 | LED9.A 212.14,16.46 212.14,6.4 LED10.A 212.24,6.4 212.55,6.1 223.42,6.1 C13.1 | v97.16,8.25 97.33,8.23 134.93,8.23 137.06,6.1 C12.1
  Top 0.406: C7.1 11.29,8.13 10.16,9.26 v10.16,20.32 | v10.16,6.98 10.16,6.72 C8.1 | v30.48,20.32 30.48,9.26 31.61,8.13 C5.1 | C6.1 30.48,6.72 v30.48,6.98 | C4.1 51.01,9.05 50.8,9.26 v50.8,20.32 | C1.1 50.8,6.72 v50.8,6.98 | v292.74,8.25 291.83,8.25 C11.1 | v281.31,8.25 279.13,8.25 C9.1 | v239.4,8.25 238.5,8.25 C15.1 | v227.97,8.25 225.79,8.25 C13.1 | v186.06,8.25 185.16,8.25 C14.1 | v174.62,8.25 174.62,7.88 C16.1 | v150.5,8.25 149.59,8.25 C10.1 | v139.06,8.25 139.06,7.88 C12.1 | v97.16,8.25 96.25,8.25 C3.1 | v85.72,8.25 85.72,7.88 C2.1
  Bottom 0.254: v50.9,8.94 50.8,8.94 | 9.53,22.23 11.28,23.98 26.52,23.98 27.53,22.96 IC3.16 | 29.34,22.73 31.39,24.79 42.88,24.79 44.7,22.96 47.85,22.96 IC2.16 | J1.7 77.52,22.96 77.52,18.8 86.26,10.06 IC7.16 | U$1.1ANODE+ 96.52,11.28 97.74,10.06 IC8.16 | J2.7 77.42,2.74 67.46,12.7 C17.+ 65.02,12.7 61.37,9.04 v57.4,9.04 | v140.31,10.97 139.8,10.46 139.8,10.06 IC11.16 | U$3.1ANODE+ 149.86,11.28 151.08,10.06 IC12.16 | v175.87,10.97 175.36,10.46 175.36,10.06 IC9.16 | 185.42,22.55 185.42,11.28 186.64,10.06 IC10.16 | 185.42,22.55 U$2.1ANODE+ | 185.42,22.55 154.53,22.55 153.42,23.67 152.4,23.67 U$3.2ANODE+ | U$5.1ANODE+ 292.1,11.28 293.32,10.06 IC16.16 | 238.76,20.93 238.76,11.28 239.98,10.06 IC14.16 | 238.76,20.93 U$4.1ANODE+ | 238.76,20.93 246.58,20.93 250.95,16.56 265.38,16.56 LED11.A | U$2.2ANODE+ 187.96,23.67 188.98,23.67 196.09,16.56 212.04,16.56 LED9.A
  Bottom 0.406: v10.16,20.32 10.16,21.59 9.53,22.23 8.89,22.86 IC6.16 | IC5.16 8.89,11.43 10.16,10.16 v10.16,6.98 | IC3.16 29.21,22.86 29.34,22.73 30.48,21.59 v30.48,20.32 | v30.48,6.98 30.48,10.16 29.21,11.43 IC4.16 | v50.8,20.32 50.8,21.59 49.53,22.86 IC2.16 | v50.8,6.98 50.8,8.94 50.8,10.16 49.53,11.43 IC1.16 | IC16.16 293.37,8.89 v292.74,8.25 | IC15.16 281.94,8.89 v281.31,8.25 | IC14.16 240.03,8.89 v239.4,8.25 | IC13.16 228.6,8.89 v227.97,8.25 | IC10.16 186.69,8.89 v186.06,8.25 | IC9.16 175.26,8.89 v174.62,8.25 | IC12.16 151.13,8.89 v150.5,8.25 | IC11.16 139.7,8.89 v139.06,8.25 | IC8.16 97.79,8.89 v97.16,8.25 | IC7.16 86.36,8.89 v85.72,8.25

## Text on the board
tNames: GND | !EN | RCLK | !RESET | SCLK | SER_IN | VCC